# Altium schematic sheet SAMD21.SchDoc
size Legal; DocumentNumber: 2; SheetNumber: 2; SheetTotal: 8; Project: Olympus
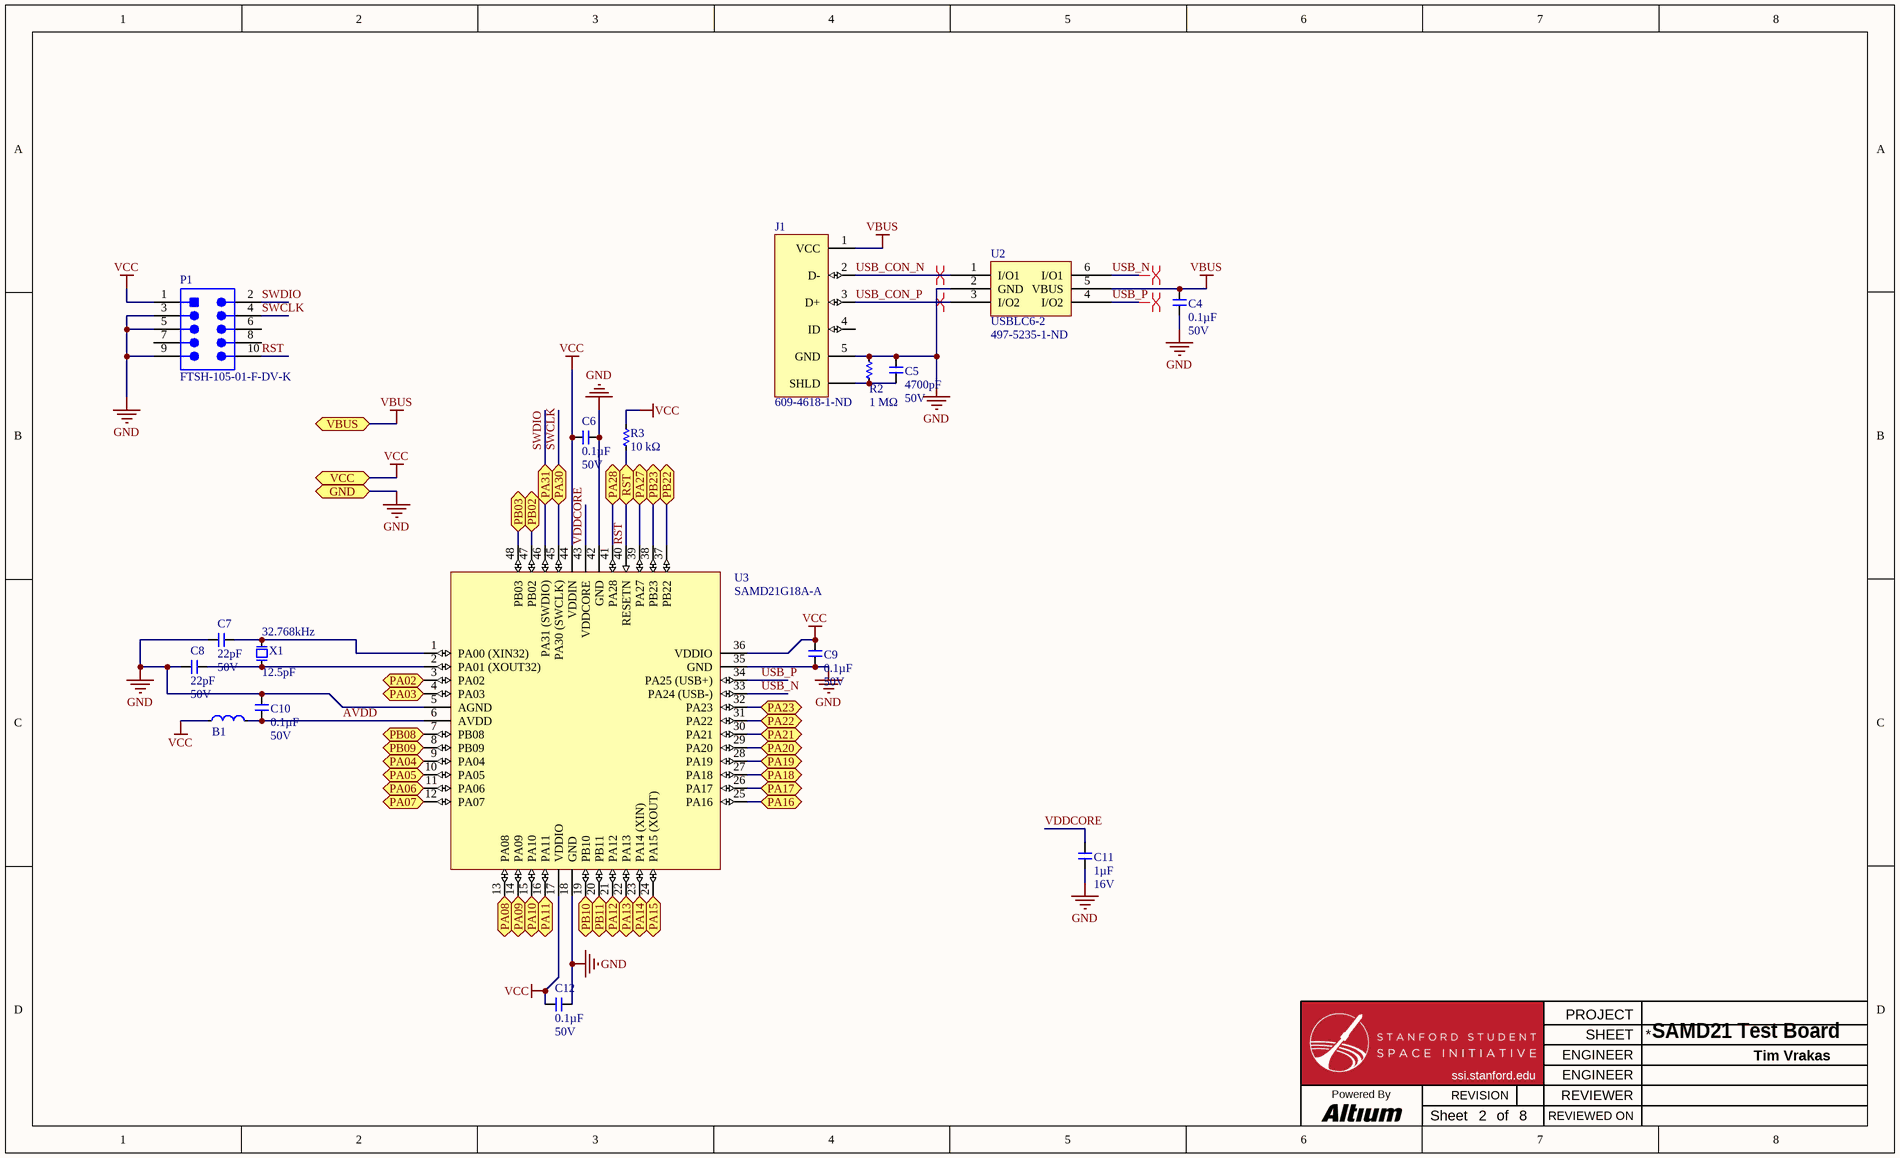
[diagram p0: SAMD21.SchDoc]

## Parts
B1  FB_1608  [R0603]  (value not drawn)
C4  Capacitance (shorthand): 0.1µF  Rated Voltage: 50V  [C0603]  (hidden comment: __template_cap)
C5  Capacitance (shorthand): 4700pF  Rated Voltage: 50V  [C0603]  (hidden comment: __template_cap)
C6  Capacitance (shorthand): 0.1µF  Rated Voltage: 50V  [C0603]  (hidden comment: __template_cap)
C7  Capacitance (shorthand): 22pF  Rated Voltage: 50V  [C0603]  (hidden comment: __template_cap)
C8  Capacitance (shorthand): 22pF  Rated Voltage: 50V  [C0603]  (hidden comment: __template_cap)
C9  Capacitance (shorthand): 0.1µF  Rated Voltage: 50V  [C0603]  (hidden comment: __template_cap)
C10  Capacitance (shorthand): 0.1µF  Rated Voltage: 50V  [C0603]  (hidden comment: __template_cap)
C11  Capacitance (shorthand): 1µF  Rated Voltage: 16V  [C0603]  (hidden comment: __template_cap)
C12  Capacitance (shorthand): 0.1µF  Rated Voltage: 50V  [C0603]  (hidden comment: __template_cap)
J1  Supplier Part Number 1: 609-4618-1-ND  [CONN_USBMICROB_10118194-0001LF]  (hidden comment: CONN_USB_MICROB_SMD_TH_R/A)
P1  FTSH-105-01-F-DV-K  [SMTC-FTSH-105-01-L-DV-K_V]
R2  Resistance: 1 MΩ  [R0603]  (hidden comment: __template_resistor)
R3  Resistance: 10 kΩ  [R0603]  (hidden comment: __template_resistor)
U2  USBLC6-2  Supplier Part Number 1: 497-5235-1-ND  [6SOT23]
U3  SAMD21G18A-A  [SAMD21 TQFP-48]
X1  Frequency: 32.768kHz  Load Capacitance: 12.5pF  [XTAL_TXC_9HT10]  (hidden comment: XTAL_9HT10-32.768KEZF-T)

## Ports
GND (bidir), PA02 (bidir), PA03 (bidir), PA04 (bidir), PA05 (bidir), PA06 (bidir), PA07 (bidir), PA08 (bidir), PA09 (bidir), PA10 (bidir), PA11 (bidir), PA12 (bidir), PA13 (bidir), PA14 (bidir), PA15 (bidir), PA16 (bidir), PA17 (bidir), PA18 (bidir), PA19 (bidir), PA20 (bidir), PA21 (bidir), PA22 (bidir), PA23 (bidir), PA27 (bidir), PA28 (bidir), PA30 (bidir), PA31 (bidir), PB02 (bidir), PB03 (bidir), PB08 (bidir), PB09 (bidir), PB10 (bidir), PB11 (bidir), PB22 (bidir), PB23 (bidir), RST (bidir), VBUS (bidir), VCC (bidir)

## Nets
GND: C4.2 C5.1 C6.2 C7.1 C8.1 C9.2 C10.1 C11.2 C12.2 J1.5(GND) P1.3 P1.5 P1.9 R2.2 U2.2(GND) U3.5(AGND) U3.18(GND) U3.35(GND) U3.42(GND) ; port GND
VBUS: C4.1 J1.1(VCC) U2.5(VBUS) ; port VBUS
VCC: B1.1 C6.1 C9.1 C12.1 P1.1 R3.2 U3.17(VDDIO) U3.36(VDDIO) U3.44(VDDIN) ; port VCC
AVDD: B1.2 C10.2 U3.6(AVDD)
PA02: U3.3(PA02) ; port PA02
PA03: U3.4(PA03) ; port PA03
PA04: U3.9(PA04) ; port PA04
PA05: U3.10(PA05) ; port PA05
PA06: U3.11(PA06) ; port PA06
PA07: U3.12(PA07) ; port PA07
PA08: U3.13(PA08) ; port PA08
PA09: U3.14(PA09) ; port PA09
PA10: U3.15(PA10) ; port PA10
PA11: U3.16(PA11) ; port PA11
PA12: U3.21(PA12) ; port PA12
PA13: U3.22(PA13) ; port PA13
PA14: U3.23(PA14_(XIN)) ; port PA14
PA15: U3.24(PA15_(XOUT)) ; port PA15
PA16: U3.25(PA16) ; port PA16
PA17: U3.26(PA17) ; port PA17
PA18: U3.27(PA18) ; port PA18
PA19: U3.28(PA19) ; port PA19
PA20: U3.29(PA20) ; port PA20
PA21: U3.30(PA21) ; port PA21
PA22: U3.31(PA22) ; port PA22
PA23: U3.32(PA23) ; port PA23
PA27: U3.39(PA27) ; port PA27
PA28: U3.41(PA28) ; port PA28
PB02: U3.47(PB02) ; port PB02
PB03: U3.48(PB03) ; port PB03
PB08: U3.7(PB08) ; port PB08
PB09: U3.8(PB09) ; port PB09
PB10: U3.19(PB10) ; port PB10
PB11: U3.20(PB11) ; port PB11
PB22: U3.37(PB22) ; port PB22
PB23: U3.38(PB23) ; port PB23
RST: P1.10 R3.1 U3.40(RESETN) ; port RST
SWCLK: P1.4 U3.45(PA30_(SWCLK)) ; port PA30
SWDIO: P1.2 U3.46(PA31_(SWDIO)) ; port PA31
USB_CON_N: J1.2(D-) U2.1(I/O1)
USB_CON_P: J1.3(D+) U2.3(I/O2)
USB_N: U2.6(I/O1) U3.33(PA24_(USB-))
USB_P: U2.4(I/O2) U3.34(PA25_(USB+))
VDDCORE: C11.1 U3.43(VDDCORE)
NetC5_2: C5.2 J1.SHIELD(SHLD) R2.1
NetC7_2: C7.2 U3.1(PA00_(XIN32)) X1.2
NetC8_2: C8.2 U3.2(PA01_(XOUT32)) X1.1

Not connected (* = marked no-connect by the designer): J1 4(ID); P1 6 7 8

## Layout directives
differential pair: USB_CON_N, USB_CON_P, USB_N, USB_P

## Notes on the sheet
- SAMD21 Test Board
- Tim Vrakas
- PROJECT
- SHEET
- Powered By
- Sheet
- of
- REVISION
- ssi.stanford.edu
- ENGINEER
- REVIEWER
- REVIEWED ON

## Library data of the parts
B1 = FB_1608: FERRITE BEAD 600 OHM 300mA; Manufacturer: Taiyo Yuden; Manufacturer Part Number: BK1608HW601-T; Number of Lines: 1; Impedance @ Frequency: 600 Ohm @ 100MHz; DC Resistance (DCR) (Max): 400 mOhm; Supplier 1: Digi-Key; Supplier Part Number 1: 587-1879-1-ND; RoHS: RoHS Compliant; Category: Filters; Stock 1: 11908; Pricing 1: 1=0.1, 10=0.059, 50=0.0474, 100=0.0426, 250=0.0312, 500=0.0227, 1000=0.02223 (USD); Packaging: Cut Tape (CT); Part Status: Active; Filter Type: -; Current Rating (Max): 300mA; Ratings: -; Operating Temperature: -55°C ~ 125°C; Package / Case: 0603 (1608 Metric); Mounting Type: Surface Mount; Height (Max): 0.037" (0.95mm); Size / Dimension: 0.063" L x 0.031" W (1.60mm x 0.80mm); ComponentLink1URL: http://ds.yuden.co.jp/TYCOMPAS/ut/detail.do?productNo=BK1608HW601-T&fileName=BK1608HW601-T_SS&mode=specSheetDownload; ComponentLink1Description: http://ds.yuden.co.jp/TYCOMPAS/ut/detail.do?productNo=BK1608HW601-T&fileName=BK1608HW601-T_SS&mode=specSheetDownload
C4 C6 C9 C10 C12 = 490-1519-1-ND: CAP CER 0603 0.1µF X7R 50V 10%; Manufacturer: Murata Electronics North America; Capacitance - pF (Machine readable): 100000; type: capacitor; Supplier Part Number 1: 490-1519-1-ND; Dielectric: X7R; Supplier 1: Digikey
C5 = 490-1506-1-ND: CAP CER 0603 4700pF X7R 50V 10%; Manufacturer: Murata Electronics North America; Capacitance - pF (Machine readable): 4700; type: capacitor; Supplier Part Number 1: 490-1506-1-ND; Dielectric: X7R; Supplier 1: Digikey
C7 C8 = 490-1411-1-ND: CAP CER 22PF 50V C0G/NP0 0603; Manufacturer: Murata Electronics North America; Capacitance - pF (Machine readable): 22; type: capacitor; Dielectric: C0G, NP0; Supplier Part Number 1: 490-1411-1-ND; Supplier 1: Digikey
C11 = 490-3900-1-ND: CAP CER 0603 1µF X7R 16V 10%; Manufacturer: Murata Electronics North America; Capacitance - pF (Machine readable): 1000000; type: capacitor; Supplier Part Number 1: 490-3900-1-ND; Dielectric: X7R; Supplier 1: Digikey
J1 = CONN_USB_MICROB_SMD_TH_R/A: CONN RCPT USB2.0 MICRO B SMD R/A; Manufacturer: Amphenol FCI; Manufacturer Part Number: 10118194-0001LF; Gender: Receptacle; Current Rating: 1.8A; Connector Type: USB,Receptacle; Number of Contacts: 5; Insulation Resistance: 1GR; Number of Ports: 1; Max Voltage Rating (AC): 100V; Pitch: 0.65mm; Supplier 1: Digi-Key; Stock 1: 180464; Pricing 1: 1=0.46, 10=0.437, 25=0.3744, 50=0.318, 100=0.3056, 250=0.2744, 500=0.262 (USD); Mount: Surface Mount,Horizontal; Contact Material: Copper Alloy; Contact Plating: Nickel,Gold; Number of Terminals: 5; Housing Material: Polymer; Colour: Black; Min Operating Temperature: -55°C; Max Operating Temperature: 85°C; Package Quantity: 9600; Packaging: Tape and Reel; Termination: Solder; Orientation: Right Angle; Length: 8.05mm; Depth: 5mm; Radiation Hardening: No; Lead Free: Lead Free; Flammability Rating: UL94 V-0; ComponentLink1URL: https://datasheet.ciiva.com/851/10118194-851110.pdf; ComponentLink1Description: https://datasheet.ciiva.com/851/10118194-851110.pdf; ComponentLink2URL: https://datasheet.ciiva.com/851/10118194-851111.pdf; ComponentLink2Description: https://datasheet.ciiva.com/851/10118194-851111.pdf; ComponentLink3URL: https://datasheet.ciiva.com/4598/10118194ac-197217-4598807.pdf; ComponentLink3Description: https://datasheet.ciiva.com/4598/10118194ac-197217-4598807.pdf; ComponentLink4URL: https://datasheet.ciiva.com/29907/10118194-29907230.pdf; ComponentLink4Description: https://datasheet.ciiva.com/29907/10118194-29907230.pdf; ComponentLink5URL: https://datasheet.ciiva.com/26945/getdatasheetpartid-418619-26945695.pdf; ComponentLink5Description: https://datasheet.ciiva.com/26945/getdatasheetpartid-418619-26945695.pdf
P1 = CMP-2000-05352-1: Male Header, Pitch 1.27 mm, 2 x 5 Position, Height 6.12 mm, RoHS, Tube; Manufacturer: Samtec; Number of Positions: 10; Connector Type: Header,Shrouded; Number of Positions Loaded: All; Row Spacing: 0.050"(1.27mm); Fastening Type: -; Package Reference: FTSH-105-01-L-DV-K; Termination: Solder; Package URL: http://suddendocs.samtec.com/prints/ftsh-1xx-xx-xxx-dv-xxx-footprint.pdf; Number of Rows: 2; Contact Finish Thickness: 3µin(0.08µm); Contact Type: MalePin; Manufacturer URL: http://www.samtec.com/; Series: FTSH; Features: -; Contact Finish: Gold; Color: Black; Family: RectangularConnectors-Headers,MalePins; Datasheet URL: http://suddendocs.samtec.com/prints/ftsh-1xx-xx-xxx-dv-xxx-mkt.pdf; Package Description: Male Header, Pitch 1.27 mm, 2 x 5 Position, Height 5.97 mm, Tail Length 4.32 mm; Mounting Type: SurfaceMount; Datasheet Version: Rev. ET, 10/1995; Category: Connectors,Interconnects; Packaging: Tube; Contact Mating Length: 0.120"(3.05mm); Pitch: 0.050"(1.27mm)
R2 = RES SMD 1M OHM 1% 1/10W 0603: Manufacturer Part Number: RC0603FR-071ML; Manufacturer: Yageo; Resistance (Sortable): 1000000; Power (Watts): 0.1W, 1/10W; Temperature Coefficient: ±100ppm/°C; Supplier 1: Digikey; Datasheets: http://www.yageo.com/documents/recent/PYu-RC_Group_51_RoHS_L_9.pdf; Image: //media.digikey.com/Renders/Yageo%20Renders/0603-(1608-Metric).jpg; Supplier Part Number 1: 311-1.00MHRCT-ND; Tolerance: ±1%; Operating Temperature: -55°C ~ 155°C
R3 = RES SMD 10K OHM 1% 1/10W 0603: Manufacturer Part Number: RC0603FR-0710KL; Manufacturer: Yageo; Resistance (Sortable): 10000; Power (Watts): 0.1W, 1/10W; Temperature Coefficient: ±100ppm/°C; Supplier 1: Digikey; Datasheets: http://www.yageo.com/documents/recent/PYu-RC_Group_51_RoHS_L_9.pdf; Image: //media.digikey.com/Renders/Yageo%20Renders/0603-(1608-Metric).jpg; Supplier Part Number 1: 311-10.0KHRCT-ND; Tolerance: ±1%; Operating Temperature: -55°C ~ 155°C
U2 = USBLC6-2: Manufacturer: STMicroelectronics; Manufacturer Part Number: USBLC6-2SC6; Unidirectional Channels: 2; Voltage - Reverse Standoff (Typ): 5.25V; Voltage - Breakdown (Min): 6V; Voltage - Clamping (Max) @ Ipp: 17V; Current - Peak Pulse (10/1000µs): 5A (8/20µs); Power Line Protection: Yes; Supplier 1: Digi-Key; RoHS: RoHS Compliant; Category: Circuit Protection; Stock 1: 31719; Pricing 1: 1=0.51, 10=0.411, 100=0.2802, 500=0.21012, 1000=0.15759 (USD); Packaging: Cut Tape (CT); Part Status: Active; Type: Steering (Rail to Rail); Bidirectional Channels: -; Power - Peak Pulse: -; Applications: Ethernet; Capacitance @ Frequency: -; Operating Temperature: -40°C ~ 125°C (TJ); Mounting Type: Surface Mount; Package / Case: SOT-23-6; Supplier Device Package: SOT-23-6; ComponentLink1URL: http://www.st.com/web/en/resource/technical/document/datasheet/CD00050750.pdf; ComponentLink1Description: http://www.st.com/web/en/resource/technical/document/datasheet/CD00050750.pdf
U3 = SAMD21G18A-A: 48Mhz Atmel SAM ARM Cortex M0+; ComponentLink1Description: Product Page; ComponentLink1URL: https://www.microchip.com/wwwproducts/en/ATSAMD21G18; ComponentLink2Description: Datasheet; ComponentLink2URL: http://ww1.microchip.com/downloads/en/DeviceDoc/SAM-D21-Family-Datasheet-DS40001882C.pdf; Supplier 1: Digi-Key; Supplier Part Number 1: ATSAMD21G18A-AU-ND
X1 = XTAL_9HT10-32.768KEZF-T: CRYSTAL 32.768 KHZ 12.5 PF SMD; Manufacturer: TXC CORPORATION; Frequency Tolerance: ±10ppm; ESR (Equivalent Series Resistance): 70 kOhm; Operating Mode: Fundamental; Supplier 1: Digi-Key; Manufacturer Part Number: 9HT10-32.768KEZF-T; RoHS: RoHS Compliant; Category: Crystals and Oscillators; Stock 1: 5250; Pricing 1: 1=1.88, 10=1.625, 50=1.425, 100=1.125, 500=0.95, 1000=0.75 (USD); Type: kHz Crystal (Tuning Fork); Frequency Stability: -; Operating Temperature: -40°C ~ 85°C; Ratings: -; Mounting Type: Surface Mount; Package / Case: 2-SMD; Size / Dimension: 0.126" L x 0.059" W (3.20mm x 1.50mm); Height: 0.033" (0.85mm); Packaging: Cut Tape (CT); ComponentLink1URL: http://www.txccrystal.com/images/pdf/9ht10.pdf; ComponentLink1Description: Datasheet; Supplier Part Number 1: 887-1507-1-ND